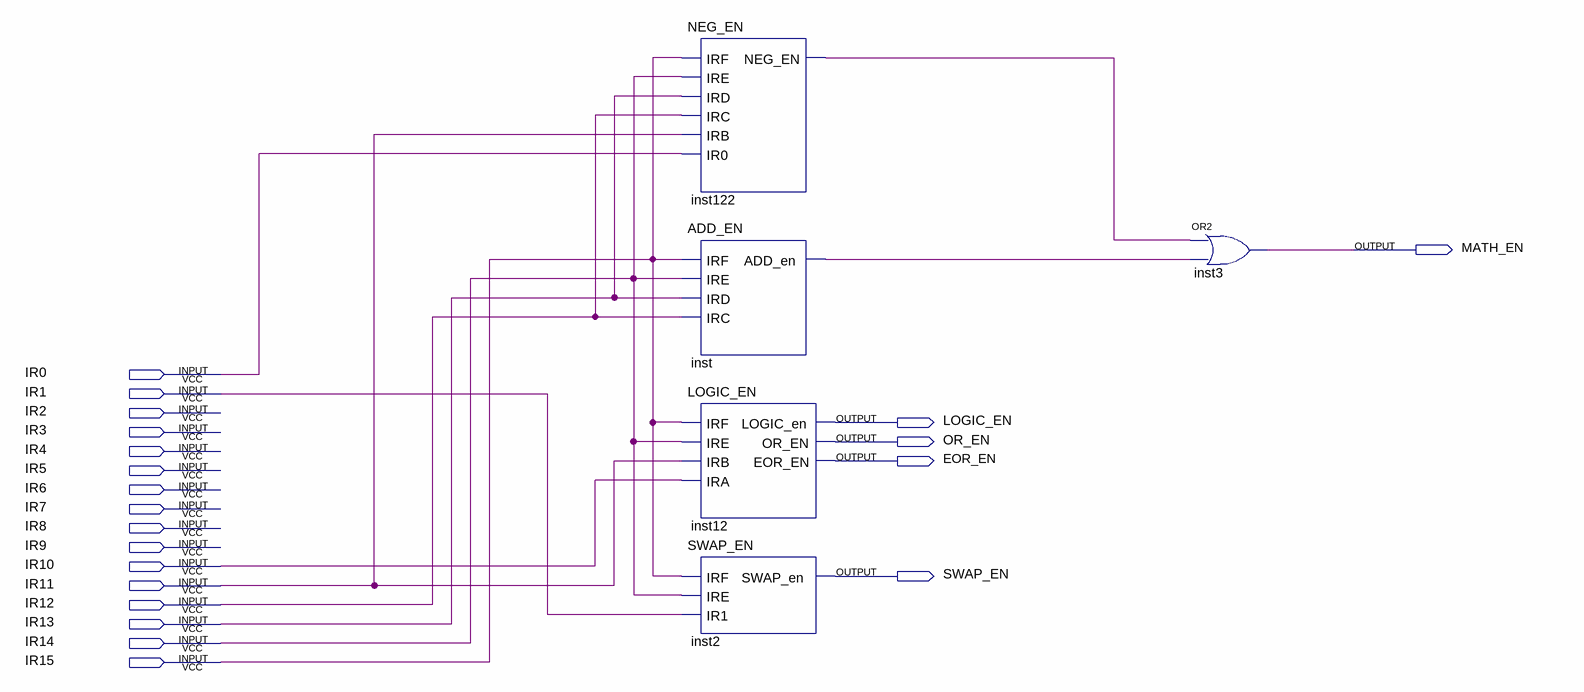
[diagram p0: schematic sheet]
// Quartus schematic ALU_Control.bdf as structural Verilog: 5 symbols, 21 pins
module ALU_Control (
  input  IR0,
  input  IR1,
  input  IR2,
  input  IR3,
  input  IR4,
  input  IR5,
  input  IR6,
  input  IR7,
  input  IR8,
  input  IR9,
  input  IR10,
  input  IR11,
  input  IR12,
  input  IR13,
  input  IR14,
  input  IR15,
  output MATH_EN,
  output LOGIC_EN,
  output OR_EN,
  output EOR_EN,
  output SWAP_EN
);

  wire inst122_neg_en, inst_add_en;

  NEG_EN inst122 (.IRF(IR15), .IRE(IR14), .IRD(IR13), .IRC(IR12), .IRB(IR11), .IR0(IR0), .NEG_EN(inst122_neg_en));
  ADD_EN inst (.IRF(IR15), .IRE(IR14), .IRD(IR13), .IRC(IR12), .ADD_en(inst_add_en));
  LOGIC_EN inst12 (.IRF(IR15), .IRE(IR14), .IRB(IR11), .IRA(IR10), .LOGIC_en(LOGIC_EN), .OR_EN(OR_EN), .EOR_EN(EOR_EN));
  SWAP_EN inst2 (.IRF(IR15), .IRE(IR14), .IR1(IR1), .SWAP_en(SWAP_EN));
  or inst3 (MATH_EN, inst122_neg_en, inst_add_en);
endmodule
